# Altium schematic sheet 1 - Power.SchDoc
size A4
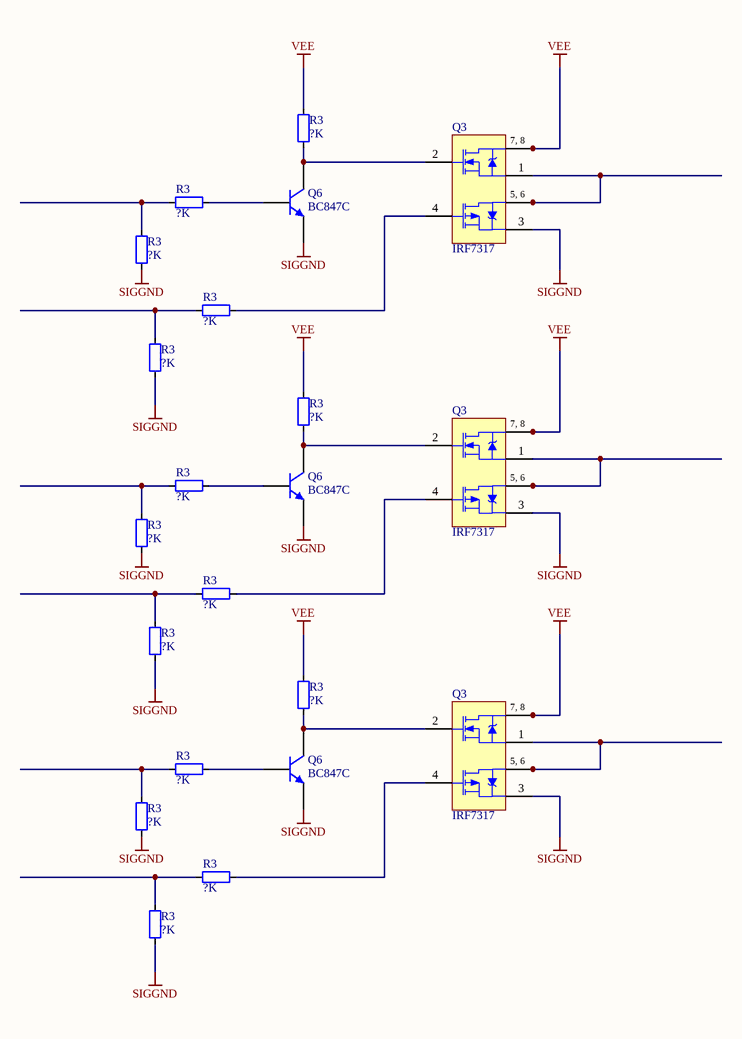
[diagram p0: 1 - Power.SchDoc]

## Parts
(Parts that share a designator on the sheet are numbered #1, #2 ... from top to bottom, then left to right.)
Q3#1  IRF7317  [SO-8_N]
Q3#2  IRF7317  [SO-8_N]
Q3#3  IRF7317  [SO-8_N]
Q6#1  BC847C  [SOT23_N]
Q6#2  BC847C  [SOT23_N]
Q6#3  BC847C  [SOT23_N]
R3#1  value ?K  [RES_0603]  (hidden comment: Res_0603)
R3#2  value ?K  [RES_0603]  (hidden comment: Res_0603)
R3#3  value ?K  [RES_0603]  (hidden comment: Res_0603)
R3#4  value ?K  [RES_0603]  (hidden comment: Res_0603)
R3#5  value ?K  [RES_0603]  (hidden comment: Res_0603)
R3#6  value ?K  [RES_0603]  (hidden comment: Res_0603)
R3#7  value ?K  [RES_0603]  (hidden comment: Res_0603)
R3#8  value ?K  [RES_0603]  (hidden comment: Res_0603)
R3#9  value ?K  [RES_0603]  (hidden comment: Res_0603)
R3#10  value ?K  [RES_0603]  (hidden comment: Res_0603)
R3#11  value ?K  [RES_0603]  (hidden comment: Res_0603)
R3#12  value ?K  [RES_0603]  (hidden comment: Res_0603)
R3#13  value ?K  [RES_0603]  (hidden comment: Res_0603)
R3#14  value ?K  [RES_0603]  (hidden comment: Res_0603)
R3#15  value ?K  [RES_0603]  (hidden comment: Res_0603)

## Nets
SIGGND: Q3#1.3(S2) Q3#2.3(S2) Q3#3.3(S2) Q6#1.2(E) Q6#2.2(E) Q6#3.2(E) R3#3.2 R3#5.2 R3#8.2 R3#10.2 R3#13.2 R3#15.2
VEE: Q3#1.7(D1) Q3#1.8(D1) Q3#2.7(D1) Q3#2.8(D1) Q3#3.7(D1) Q3#3.8(D1) R3#1.2 R3#6.2 R3#11.2
NetQ3#1_1: Q3#1.1(S1) Q3#1.5(D2) Q3#1.6(D2)
NetQ3#1_2: Q3#1.2(G1) Q6#1.3(C) R3#1.1
NetQ3#1_4: Q3#1.4(G2) R3#4.1
NetQ3#2_1: Q3#2.1(S1) Q3#2.5(D2) Q3#2.6(D2)
NetQ3#2_2: Q3#2.2(G1) Q6#2.3(C) R3#6.1
NetQ3#2_4: Q3#2.4(G2) R3#9.1
NetQ3#3_1: Q3#3.1(S1) Q3#3.5(D2) Q3#3.6(D2)
NetQ3#3_2: Q3#3.2(G1) Q6#3.3(C) R3#11.1
NetQ3#3_4: Q3#3.4(G2) R3#14.1
NetQ6#1_1: Q6#1.1(B) R3#2.1
NetQ6#2_1: Q6#2.1(B) R3#7.1
NetQ6#3_1: Q6#3.1(B) R3#12.1
NetR3#2_2: R3#2.2 R3#3.1
NetR3#4_2: R3#4.2 R3#5.1
NetR3#7_2: R3#7.2 R3#8.1
NetR3#9_2: R3#9.2 R3#10.1
NetR3#12_2: R3#12.2 R3#13.1
NetR3#14_2: R3#14.2 R3#15.1

## Notes on the sheet
- (in symbol IRF7317) 7, 8; 5, 6

## Library data of the parts
Q3#1-Q3#3 = IRF7317: HEXFET Power MOSFET; Published: 8-Jun-2000; LatestRevisionDate: 13-Apr-2006; LatestRevisionNote: IPC-7351 Footprint Added.; DatasheetVersion: Dec-1997; PackageVersion: Feb-2001; PackageReference: SO-8; Publisher: Altium Limited; PackageDescription: 8-Pin Plastic Small Outline Integrated Circuit 1.27 mm Pitch; Code_JEDEC: MS-012-AA; Code_IPC: SOIC127P600-8; ComponentLink1Description: Manufacturer Link; ComponentLink1URL: http://www.irf.com/; ComponentLink2Description: Datasheet; ComponentLink2URL: http://www.irf.com/product-info/datasheets/data/IRFN140.pdf
Q6#1-Q6#3 = BC847C: NPN General-purpose Transistor; Published: 17-Sep-2003; LatestRevisionDate: 12-Dec-2006; LatestRevisionNote: IPC-7351 Footprint Added.; DatasheetVersion: 4-Feb-2002; PackageVersion: May-1999; PackageReference: SOT23; Publisher: Altium Limited; PackageDescription: 3-Pin SOT-23 Package 0.95 mm Pitch, 2.3 mm Lead Span; ComponentLink1Description: Manufacturer Link; ComponentLink1URL: http://www.semiconductors.philips.com/; ComponentLink2Description: Datasheet; ComponentLink2URL: http://www.semiconductors.philips.com/acrobat/datasheets/BC846_BC847_BC848_5.pdf
R3#1-R3#15 = Res_0603: Resistor